# EAGLE design strobecontroller (EAGLE 6.2)
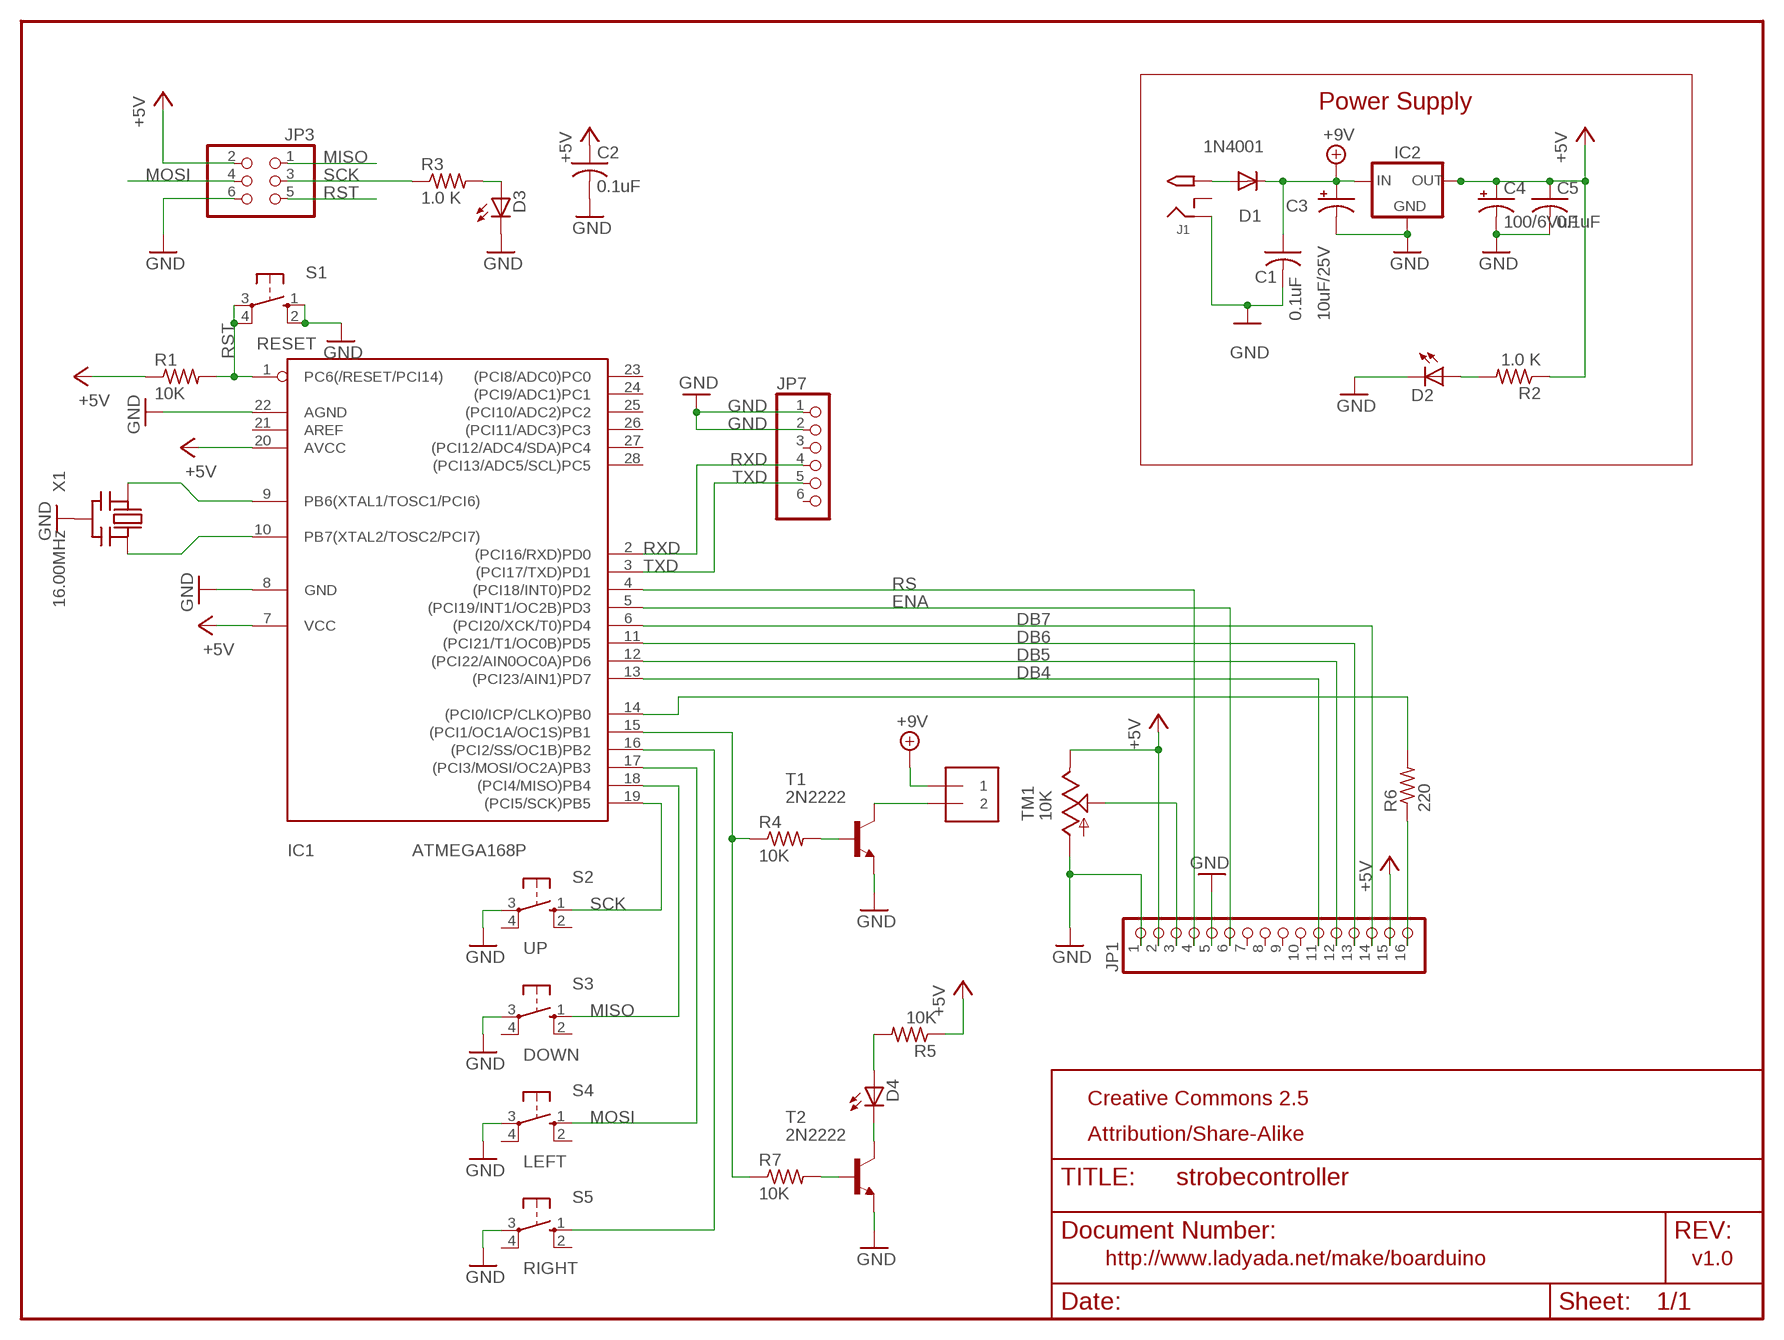
[diagram p0: schematic, sheet 1]

## Parts
C1  0.1uF  C-US025-025X050  [C025-025X050]
C2  0.1uF  C-US025-025X050  [C025-025X050]
C3  10uF/25V  CPOL-USE2.5-6  [E2,5-6]
C4  100/6VuF  CPOL-USE2.5-6  [E2,5-6]
C5  0.1uF  C-US025-025X050  [C025-025X050]
D1  1N4001  1N4004  [DO41-10]
D2  Red  LED3MM  [LED3MM]
D3  Green  LED3MM  [LED3MM]
D4  Red  LED3MM  [LED3MM]
IC1  ATMEGA168P  ATMEGA168PROUND  [DIL28/3]
IC2  78XXS  [78XXS]
J1  2.1MMJACK  [PJ-102A]
J2  1X2-3.5MM  [1X2-3.5MM]
JP1  PINHD-1X16  [1X16]
JP3  PINHD-2X3  [2X03]
JP7  PINHD-1X6CLEAN  [1X06-CLEAN]
R1  10K  R-US_0207/5V  [0207/5V]
R2  1.0 K  R-US_0207/5V  [0207/5V]
R3  1.0 K  R-US_0207/5V  [0207/5V]
R4  10K  R-US_0207/5V  [0207/5V]
R5  10K  R-US_0207/5V  [0207/5V]
R6  220  R-US_0207/5V  [0207/5V]
R7  10K  R-US_0207/5V  [0207/5V]
S1  RESET  10-XX  [B3F-10XX]
S2  UP  10-XX  [B3F-10XX]
S3  DOWN  10-XX  [B3F-10XX]
S4  LEFT  10-XX  [B3F-10XX]
S5  RIGHT  10-XX  [B3F-10XX]
T1  2N2222  [TO92-EBC-OVAL]
T2  2N2222  [TO92-EBC-OVAL]
TM1  10K  TRIM  [6MM]
X1  16.00MHz  CERMOSCILL  [CERM_OSC]

## Nets
+5V: C2.1 C4.+ C5.1 IC1.7(VCC) IC1.20(AVCC) IC2.OUT JP1.2 JP1.15 JP3.2 R1.1 R2.1 R5.1 TM1.E
+9V: C1.1 C3.+ D1.C IC2.IN J2.1
DB4: IC1.13((PCI23/AIN1)PD7) JP1.11
DB5: IC1.12((PCI22/AIN0OC0A)PD6) JP1.12
DB6: IC1.11((PCI21/T1/OC0B)PD5) JP1.13
DB7: IC1.6((PCI20/XCK/T0)PD4) JP1.14
ENA: IC1.5((PCI19/INT1/OC2B)PD3) JP1.6
GND: C1.2 C2.2 C3.- C4.- C5.2 D2.K(C) D3.K(C) IC1.8(GND) IC1.22(AGND) IC2.GND J1.RING JP1.1 JP1.5 JP3.6 JP7.1 JP7.2 S1.1(S) S1.2(S1) S2.3(P) S3.3(P) S4.3(P) S5.3(P) T1.E T2.E TM1.A X1.P$2(GND)
MISO: IC1.18((PCI4/MISO)PB4) JP3.1 S3.1(S)
MOSI: IC1.17((PCI3/MOSI/OC2A)PB3) JP3.4 S4.1(S)
N$1: IC1.9(PB6(XTAL1/TOSC1/PCI6)) X1.P$1(IN)
N$2: IC1.10(PB7(XTAL2/TOSC2/PCI7)) X1.P$3(OUT)
N$3: D2.A R2.2
N$4: D3.A R3.2
N$5: JP1.16 R6.1
N$6: R4.2 T1.B
N$7: J2.2 T1.C
N$8: IC1.14((PCI0/ICP/CLKO)PB0) R6.2
N$11: IC1.16((PCI2/SS/OC1B)PB2) S5.1(S)
N$12: JP1.3 TM1.S
N$13: D4.K(C) T2.C
N$14: D4.A R5.2
N$15: R7.2 T2.B
N$16: IC1.15((PCI1/OC1A/OC1S)PB1) R4.1 R7.1
N$17: D1.A J1.TIP
RS: IC1.4((PCI18/INT0)PD2) JP1.4
RST: IC1.1(PC6(/RESET/PCI14)) JP3.5 R1.2 S1.3(P) S1.4(P1)
RXD: IC1.2((PCI16/RXD)PD0) JP7.4
SCK: IC1.19((PCI5/SCK)PB5) JP3.3 R3.1 S2.1(S)
TXD: IC1.3((PCI17/TXD)PD1) JP7.5
Unconnected: IC1.21(AREF) IC1.23((PCI8/ADC0)PC0) IC1.24((PCI9/ADC1)PC1) IC1.25((PCI10/ADC2)PC2) IC1.26((PCI11/ADC3)PC3) IC1.27((PCI12/ADC4/SDA)PC4) IC1.28((PCI13/ADC5/SCL)PC5) J1.RING_SW JP1.7 JP1.8 JP1.9 JP1.10 JP7.3 JP7.6 S2.2(S1) S2.4(P1) S3.2(S1) S3.4(P1) S4.2(S1) S4.4(P1) S5.2(S1) S5.4(P1)

## Notes on the sheet
- Power Supply
- Creative Commons 2.5
- Attribution/Share-Alike
- http://www.ladyada.net/make/boarduino | v1.0

## Library data of the parts
C1 C2 C5 = minimidi:C-US: CAPACITOR, American symbol
C3 C4 = minimidi:CPOL-US: POLARIZED CAPACITOR, American symbol
D1 = minimidi:1N4004: DIODE general purpose rectifier, 1 A
D2-D4 = minimidi:LED: LED OSRAM: - CHIPLED LG R971, LG N971, LY N971, LG Q971, LY Q971, LO R971, LY R971 LH N974, LH R974 LS Q976, LO Q976, LY Q976 LO Q996 - Hyper CHIPLED LW Q18S LB Q993, LB Q99A, LB R99A - SideLED LS A670, LO A670, LY A670, LG A670, LP A670 LB A673, LV A673, LT A673, LW A673 LH A674 LY A675 LS A676, LA A676, LO A676, LY A676, LW A676 LS A679, LY A679, LG A679 - Hyper Micro SIDELED® LS Y876, LA Y876, LO Y876, LY Y876 LT Y87S - SmartLED LW L88C, LW L88S LB L89C, LB L89S, LG L890 LS L89K, LO L89K, LY L89K LS L896, LA L896, LO L896, LY L896 - TOPLED LS T670, LO T670, LY T670, LG T670, LP T670 LSG T670, LSP T670, LSY T670, LOP T670, LYG T670 LG T671, LOG T671, LSG T671 LB T673, LV T673, LT T673, LW T673 LH T674 LS T676, LA T676, LO T676, LY T676, LB T676, LH T676, LSB T676, LW T676 LB T67C, LV T67C, LT T67C, LS T67K, LO T67K, LY T67K, LW E67C LS E67B, LA E67B, LO E67B, LY E67B, LB E67C, LV E67C, LT E67C LW T67C LS T679, LY T679, LG T679 LS T770, LO T770, LY T770, LG T770, LP T770 LB T773, LV T773, LT T773, LW T773 LH T774 LS E675, LA E675, LY E675, LS T675 LS T776, LA T776, LO T776, LY T776, LB T776 LHGB T686 LT T68C, LB T68C - Hyper Mini TOPLED® LB M676 - Mini TOPLED Santana® LG M470 LS M47K, LO M47K, LY M47K Source: http://www.osram.convergy.de/
IC1 = avr:ATMEGA168*P: MICROCONTROLLER 16 kBytes FLASH 1 kBytes SRAM 512 Bytes EEPROM USART 8-channel 10 bit ADC
IC2 = v-reg:78XXS: VOLTAGE REGULATOR
J1 = minimidi:2.1MMJACK
J2 = adafruit:1X2: 3.5mm Terminal block http://www.ladyada.net/library/pcb/eaglelibrary.html
JP1 = pinhead:PINHD-1X16: PIN HEADER
JP3 = pinhead-ez:PINHD-2X3: PIN HEADER
JP7 = carduino:PINHD-1X6: PIN HEADER
R1 R4-R7 = rcl-ez:R-US_: RESISTOR, American symbol
R2 R3 = minimidi:R-US_: RESISTOR, American symbol
S1-S5 = switch-omron:10-XX: OMRON SWITCH
T1 T2 = adafruit:2N2222: NPN TRANSISTOR Big oval pads
TM1 = adafruit:TRIM
X1 = digg:CERMOSCILL

## Board
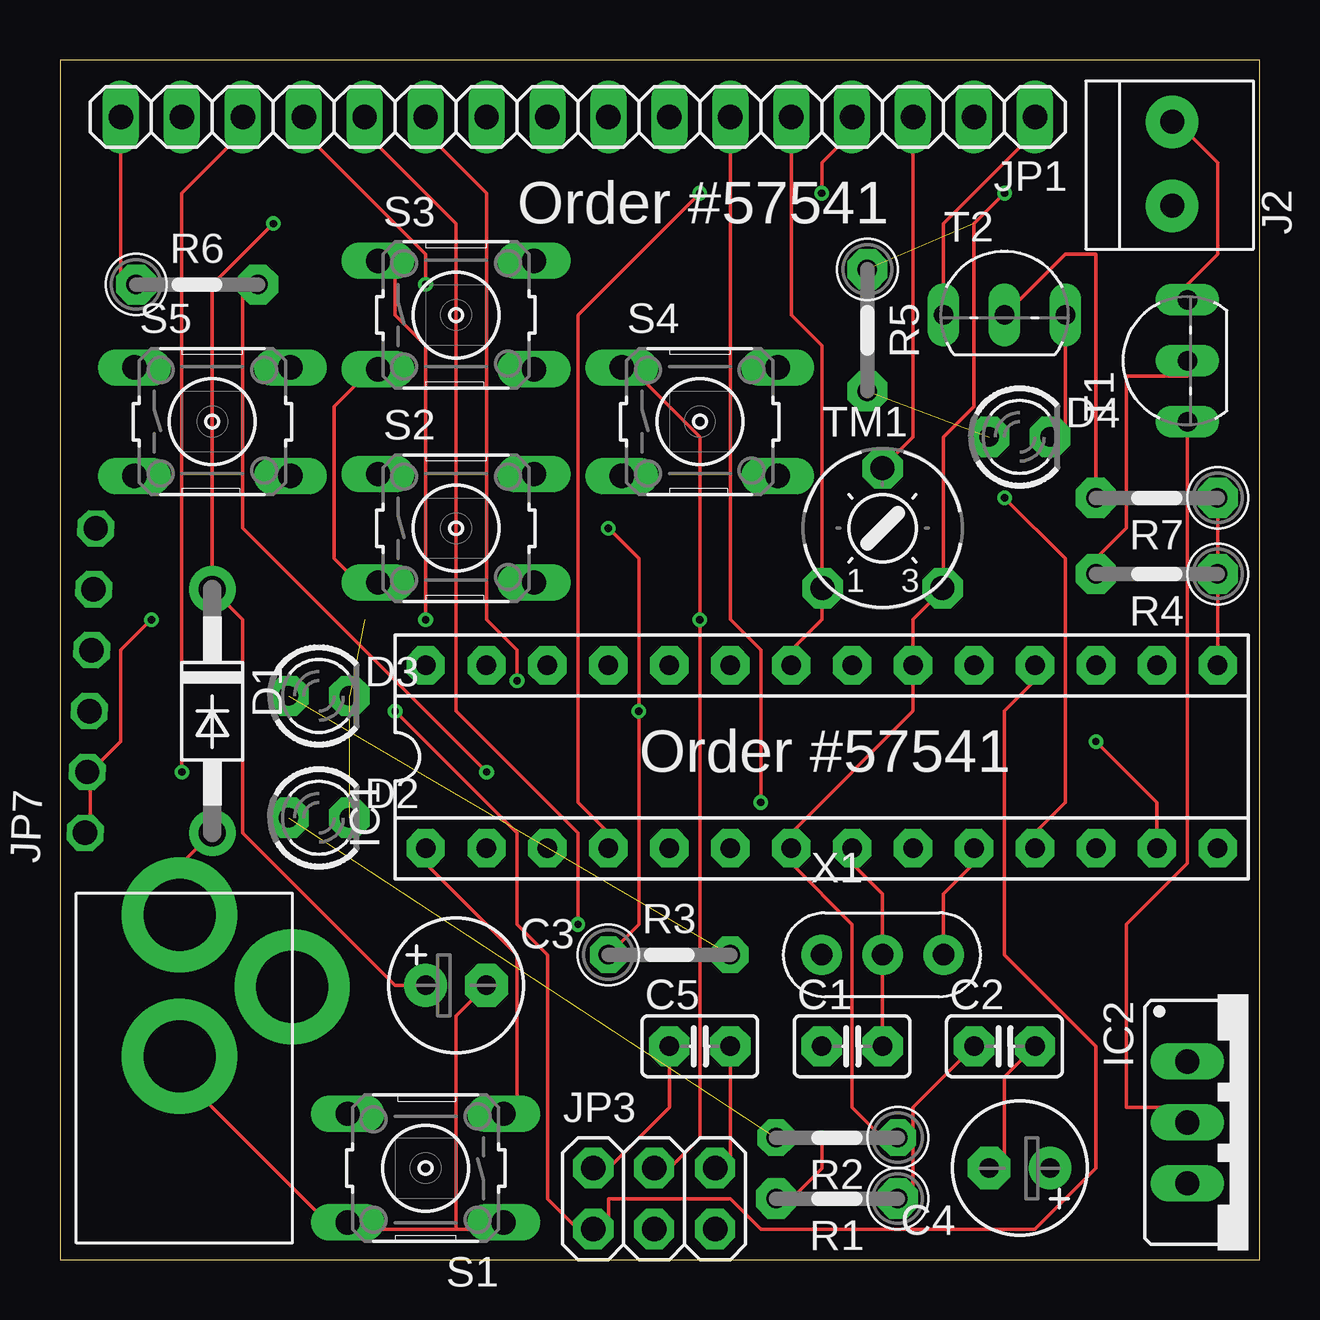
[diagram p1: board, top side]
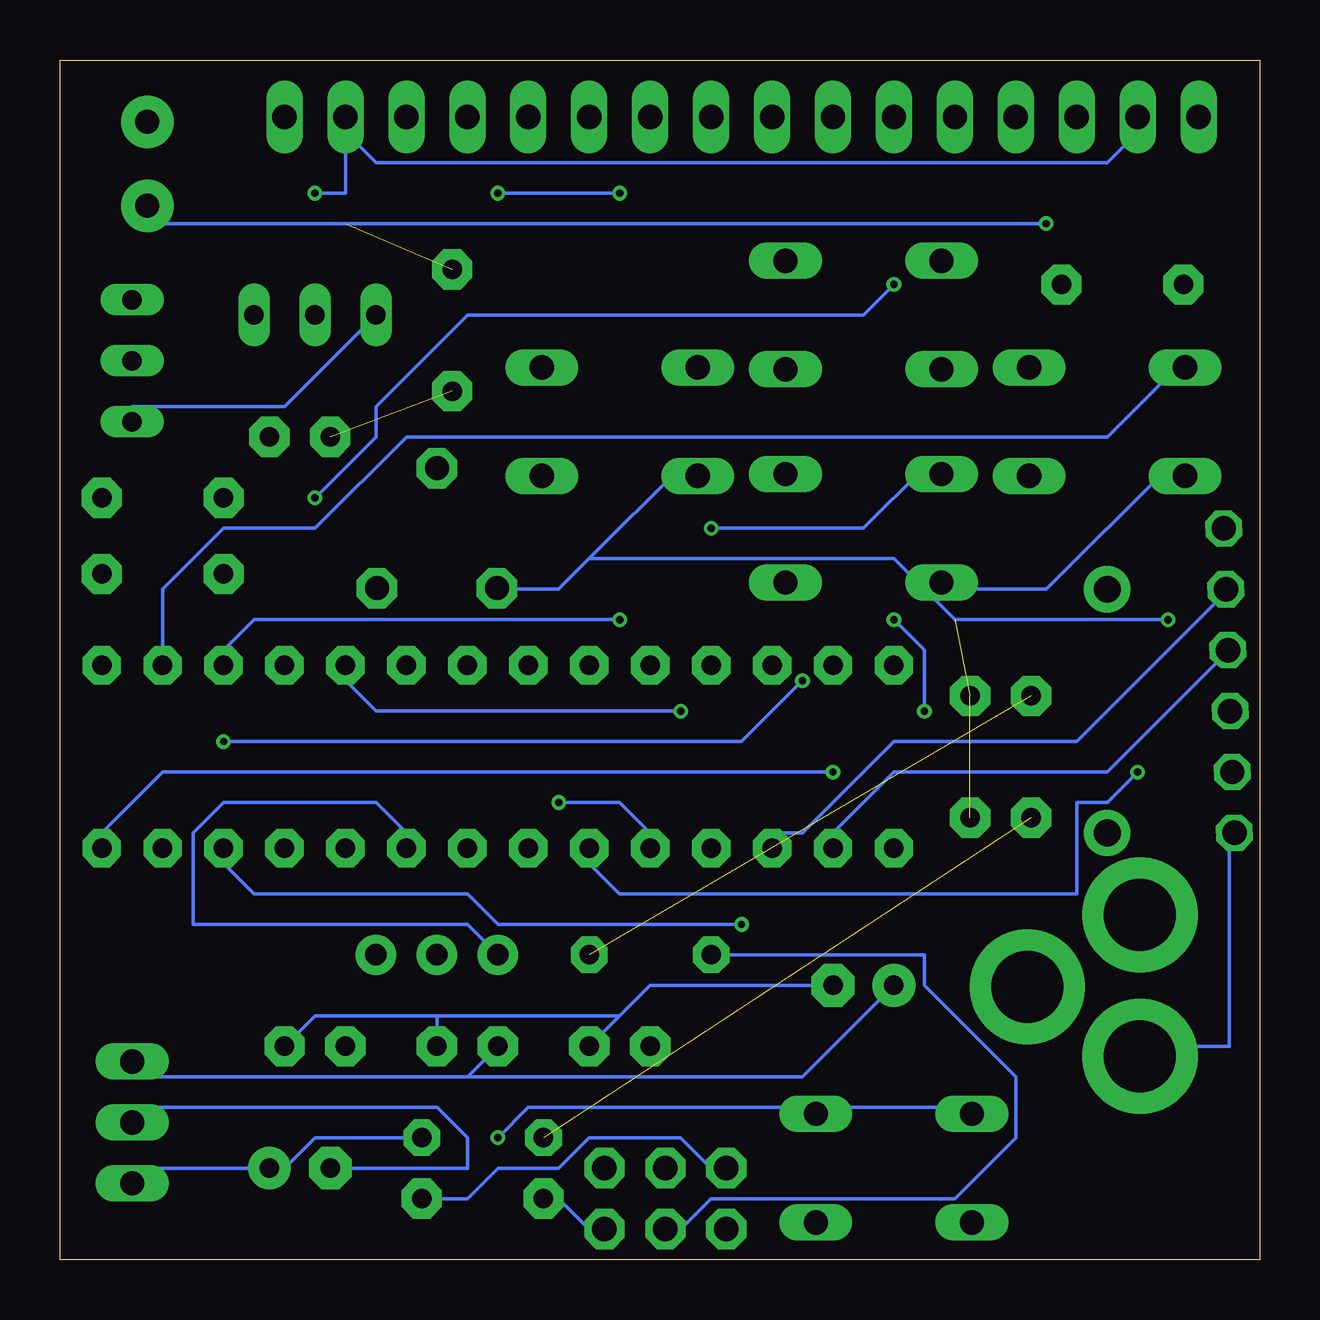
[diagram p2: board, bottom side, seen from below]

Size 50 x 50 mm. Coordinates in mm from the lower left corner, seen from the top.
Outline: 0,0 50,0 50,50 0,50 0,0
Copper layers (1*16): Top 0.035mm / dielectric 1.5mm / Bottom 0.035mm
Design rules: minimum track width 6mil, minimum drill 12mil, track to track 6mil, track to pad 6mil, pad to pad 6mil, via to via 6mil, smd to smd 0mil, copper to edge 10mil, drill to drill 10mil, minimum pad ring 10mil, minimum via ring 6mil, stop-mask expansion 2mil, vias tented up to drill 100mil, thermal gap 10mil

### Footprints (pad centres in the part's own frame; a part is rotated, then mirrored left to right if it is on the bottom)
C025-025X050 = drill 0.813 pad 1.676 octagon: 1 -1.27,0; 2 1.27,0
E2,5-6 = drill 0.813 pad 1.778: + -1.27,0 | drill 0.813 pad 1.778 octagon: - 1.27,0
DO41-10 = drill 1.118 pad 1.93: A 5.08,0; C -5.08,0
LED3MM = drill 0.813 pad 1.676 octagon: A -1.27,0; K 1.27,0
DIL28/3 = drill 0.813 pad 1.6 octagon: 1 -16.51,-3.81; 2 -13.97,-3.81; 3 -11.43,-3.81; 4 -8.89,-3.81; 5 -6.35,-3.81; 6 -3.81,-3.81; 7 -1.27,-3.81; 8 1.27,-3.81; 9 3.81,-3.81; 10 6.35,-3.81; 11 8.89,-3.81; 12 11.43,-3.81; 13 13.97,-3.81; 14 16.51,-3.81; 15 16.51,3.81; 16 13.97,3.81; 17 11.43,3.81; 18 8.89,3.81; 19 6.35,3.81; 20 3.81,3.81; 21 1.27,3.81; 22 -1.27,3.81; 23 -3.81,3.81; 24 -6.35,3.81; 25 -8.89,3.81; 26 -11.43,3.81; 27 -13.97,3.81; 28 -16.51,3.81
78XXS = drill 1.016 long: GND 0,-2.54; IN -2.54,-2.54; OUT 2.54,-2.54
PJ-102A = drill 3 pad 4.8: RING 0.1,-3.39; RING_SW -4.6,-6.29; TIP 0.1,-9.29
1X2-3.5MM = drill 1 pad 2.184: 1 1.8,0; 2 -1.7,0
1X16 = drill 1.016 long: 1 -19.05,0; 2 -16.51,0; 3 -13.97,0; 4 -11.43,0; 5 -8.89,0; 6 -6.35,0; 7 -3.81,0; 8 -1.27,0; 9 1.27,0; 10 3.81,0; 11 6.35,0; 12 8.89,0; 13 11.43,0; 14 13.97,0; 15 16.51,0; 16 19.05,0
2X03 = drill 1.016 pad 1.676 octagon: 1 -2.54,-1.27; 2 -2.54,1.27; 3 0,-1.27; 4 0,1.27; 5 2.54,-1.27; 6 2.54,1.27
1X06-CLEAN = drill 1.016 octagon: 1 -6.35,0; 2 -3.81,0; 3 -1.27,0; 4 1.27,0; 5 3.81,0; 6 6.35,0
0207/5V = drill 0.813 pad 1.676 octagon: 1 -2.54,0; 2 2.54,0
0207/5V' = drill 0.813 pad 1.524 octagon: 1 -2.54,0; 2 2.54,0
B3F-10XX = drill 1.016 long: 1 -3.251,2.261; 2 3.251,2.261; 3 -3.251,-2.261; 4 3.251,-2.261
TO92-EBC-OVAL = drill 0.813 long: B 0,-1.27; C 2.54,-1.27; E -2.54,-1.27
6MM = drill 1 pad 1.676 octagon: A -2.5,-2.5; E 2.5,-2.5; S 0,2.5
CERM_OSC = drill 0.9 pad 1.676: P$1 -2.54,0; P$2 0,0; P$3 2.54,0

### Placement (x,y rotation side)
C1  33.02,8.89 0 top
C2  39.37,8.89 0 top
C3  16.51,11.43 0 top
C4  40.01,3.81 180 top
C5  26.67,8.89 0 top
D1  6.35,22.86 270 top
D2  10.79,18.41 0 top
D3  10.79,23.5 0 top
D4  40.01,34.29 0 top
IC1  31.75,20.95 0 top
IC2  49.53,5.71 270 top
J1  5.08,5.08 180 top
J2  46.35,45.72 270 top
JP1  21.59,47.62 180 top
JP3  24.77,2.54 0 top
JP7  1.27,24.13 88 top
R1  32.38,2.54 180 top
R2  1.0 K  [0207/5V']  32.38,5.08 180 top
R3  1.0 K  [0207/5V']  25.4,12.7 0 top
R4  45.72,28.57 180 top
R5  33.66,38.73 270 top
R6  5.71,40.64 0 top
R7  45.72,31.75 180 top
S1  15.24,3.81 180 top
S2  16.51,30.48 0 top
S3  16.51,39.37 0 top
S4  26.67,34.92 0 top
S5  6.35,34.92 0 top
T1  45.72,37.47 90 top
T2  39.37,40.64 0 top
TM1  34.29,30.48 0 top
X1  34.29,12.7 0 top

### Tracks (layer width: path | path; a pad name or v marks a point on that pad's centre or on a via)
+5V  (via drill 0.3)  (1 unrouted)
  Top 0.152: 36.83,27.94 35.56,26.67 IC1.20 35.56,22.86 30.48,17.78 IC1.7 30.48,16.51 33.02,13.97 33.02,6.35 34.29,5.08 R2.1 35.56,5.08 | C5.1 25.4,6.35 22.86,3.81 JP3.2 | 35.56,5.08 35.56,2.54 R1.1 | C2.1 35.56,6.35 35.56,5.08 | v39.37,44.45 38.1,43.18 38.1,35.56 36.83,34.29 36.83,27.94 | 36.83,27.94 TM1.E
  Bottom 0.152: 38.1,46.99 36.83,45.72 6.35,45.72 5.08,46.99 JP1.15 | IC2.OUT 46.99,3.81 C4.+ 40.64,3.81 39.37,5.08 R2.1 | R1.1 33.02,2.54 31.75,3.81 29.21,3.81 27.94,5.08 24.13,5.08 22.86,3.81 JP3.2 | 38.1,46.99 38.1,44.45 v39.37,44.45 | 38.1,46.99 JP1.2
+9V  (via drill 0.3)
  Top 0.152: C3.+ 13.97,11.43 7.62,17.78 7.62,26.67 D1.C 6.35,40.64 v8.89,43.18
  Bottom 0.152: 33.02,7.62 46.99,7.62 IC2.IN | C1.1 33.02,7.62 | C3.+ 19.05,7.62 33.02,7.62 | v8.89,43.18 45.72,43.18 J2.1
DB4  (via drill 0.3)
  Top 0.152: v19.05,24.13 19.05,25.4 17.78,26.67 17.78,44.45 15.24,46.99 JP1.11 | v43.18,21.59 45.72,19.05 IC1.13
  Bottom 0.152: v19.05,24.13 21.59,21.59 v43.18,21.59
DB5  (via drill 0.3)
  Top 0.152: v21.59,13.97 21.59,17.78 16.51,22.86 16.51,43.18 12.7,46.99 JP1.12
  Bottom 0.152: v21.59,13.97 31.75,13.97 33.02,15.24 41.91,15.24 43.18,16.51 IC1.12
DB6  (via drill 0.3)
  Top 0.152: v15.24,40.64 15.24,41.91 10.16,46.99 JP1.13 | v39.37,31.75 41.91,29.21 41.91,19.05 40.64,17.78 IC1.11
  Bottom 0.152: v15.24,40.64 16.51,39.37 33.02,39.37 36.83,35.56 36.83,34.29 v39.37,31.75
DB7  (via drill 0.3)
  Top 0.152: v5.08,20.32 5.08,44.45 7.62,46.99 JP1.14
  Bottom 0.152: v5.08,20.32 6.35,19.05 7.62,19.05 7.62,15.24 26.67,15.24 27.94,16.51 IC1.6
ENA  (via drill 0.3)
  Top 0.152: JP1.6 27.94,26.67 29.21,25.4 v29.21,19.05
  Bottom 0.152: v29.21,19.05 26.67,19.05 25.4,17.78 IC1.5
GND  (via drill 0.3)  (2 unrouted)
  Top 0.152: S2.3 12.7,27.94 11.43,29.21 11.43,35.56 12.7,36.83 S3.3 | JP1.5 30.48,39.37 31.75,38.1 31.75,27.94 | 31.75,27.94 31.75,26.67 30.48,25.4 IC1.22 | 31.75,27.94 TM1.A | T1.E 46.99,16.51 44.45,13.97 44.45,6.35 46.99,6.35 IC2.GND | T2.E 36.83,43.18 40.64,46.99 JP1.1 | 1.27,20.32 1.27,17.78 JP7.1 | IC1.8 33.02,16.51 34.29,15.24 X1.P$2 C1.2 | C2.2 39.37,7.62 39.37,3.81 C4.- | C5.2 27.94,3.81 JP3.6 | 16.51,1.27 17.78,1.27 S1.1 | 16.51,1.27 12.7,1.27 S1.2 11.43,1.27 5.08,7.62 J1.RING | C3.- 16.51,10.16 16.51,1.27 | v3.81,26.67 2.54,25.4 2.54,21.59 1.27,20.32 | 1.27,20.32 JP7.2
  Bottom 0.152: S5.3 3.81,33.02 8.89,27.94 12.7,27.94 S2.3 13.97,27.94 | 27.94,29.21 29.21,27.94 31.75,27.94 TM1.A | 27.94,29.21 24.13,33.02 S4.3 | 13.97,27.94 15.24,29.21 27.94,29.21 | T2.E 40.64,35.56 46.99,35.56 T1.E | JP7.1 1.27,17.78 1.27,8.89 3.81,8.89 J1.RING | 26.67,10.16 25.4,11.43 C3.- | 26.67,10.16 C5.2 | C2.2 39.37,10.16 34.29,10.16 | 26.67,10.16 34.29,10.16 | 34.29,10.16 C1.2 | C4.- 33.02,3.81 33.02,5.08 34.29,6.35 46.99,6.35 IC2.GND | 13.97,27.94 12.7,26.67 v3.81,26.67
MISO  (via drill 0.3)
  Top 0.152: v15.24,26.67 15.24,38.1 13.97,39.37 13.97,41.91 S3.1 | v13.97,22.86 19.05,17.78 19.05,13.97 20.32,12.7 20.32,2.54 21.59,1.27 JP3.1 22.86,1.27 22.86,2.54 27.94,2.54 29.21,1.27 40.64,1.27 43.18,3.81 43.18,8.89 39.37,12.7 39.37,22.86 40.64,24.13 IC1.18
  Bottom 0.152: v15.24,26.67 13.97,25.4 v13.97,22.86
MOSI  (via drill 0.3)
  Top 0.152: S4.1 24.13,36.83 26.67,34.29 v26.67,26.67 26.67,5.08 25.4,3.81 JP3.4
  Bottom 0.152: v26.67,26.67 41.91,26.67 43.18,25.4 IC1.17
N$1
  Bottom 0.152: X1.P$1 33.02,13.97 44.45,13.97 44.45,17.78 43.18,19.05 36.83,19.05 35.56,17.78 IC1.9
N$2
  Top 0.152: X1.P$3 36.83,15.24 38.1,16.51 IC1.10
N$3  (1 unrouted)
N$4  (1 unrouted)
N$5
  Top 0.152: JP1.16 2.54,40.64 R6.1
N$6
  Top 0.152: T1.B 46.99,36.83 44.45,36.83 44.45,30.48 43.18,29.21 R4.2
N$7
  Top 0.152: T1.C 46.99,40.64 48.26,41.91 48.26,45.72 46.99,46.99 J2.2
N$8  (via drill 0.3)
  Top 0.152: v17.78,20.32 7.62,30.48 7.62,40.64 R6.2
  Bottom 0.152: v17.78,20.32 45.72,20.32 48.26,17.78 IC1.14
N$11
  Bottom 0.152: IC1.16 45.72,27.94 43.18,30.48 39.37,30.48 35.56,34.29 6.35,34.29 3.81,36.83 S5.1
N$12
  Top 0.152: JP1.3 35.56,34.29 34.29,33.02 TM1.S
N$13
  Top 0.152: T2.C 41.91,34.29 D4.K
N$14  (1 unrouted)
N$15
  Top 0.152: T2.B 41.91,41.91 43.18,41.91 R7.2
N$16
  Top 0.152: IC1.15 R4.1 R7.1
N$17
  Top 0.152: D1.A 5.08,16.51 5.08,15.24 J1.TIP
RS  (via drill 0.3)
  Top 0.152: v31.75,44.45 31.75,45.72 33.02,46.99 JP1.4 | v26.67,44.45 21.59,39.37 21.59,19.05 22.86,17.78 IC1.4
  Bottom 0.152: v26.67,44.45 v31.75,44.45
RST  (via drill 0.3)
  Top 0.152: IC1.1 15.24,16.51 19.05,12.7 19.05,6.35 S1.3 | v31.75,5.08 31.75,3.81 30.48,2.54 R1.2
  Bottom 0.152: JP3.5 27.94,1.27 29.21,2.54 R1.2 | S1.4 12.7,6.35 17.78,6.35 S1.3 19.05,6.35 30.48,6.35 v31.75,5.08
RXD
  Bottom 0.152: JP7.4 1.27,25.4 6.35,20.32 15.24,20.32 17.78,17.78 IC1.2
SCK  (via drill 0.3)
  Top 0.152: v22.86,30.48 24.13,29.21 v24.13,22.86 24.13,13.97 R3.1
  Bottom 0.152: v22.86,30.48 16.51,30.48 13.97,33.02 S2.1 | v24.13,22.86 36.83,22.86 38.1,24.13 IC1.19 | R3.1 13.97,12.7 13.97,11.43 10.16,7.62 10.16,5.08 12.7,2.54 22.86,2.54 24.13,1.27 JP3.3
TXD
  Bottom 0.152: JP7.5 1.27,27.94 7.62,21.59 15.24,21.59 19.05,17.78 20.32,17.78 IC1.3

### Text on the board
tNames: Order #57541 | Order #57541